# EAGLE design Dc motor control (EAGLE 7.7.0)
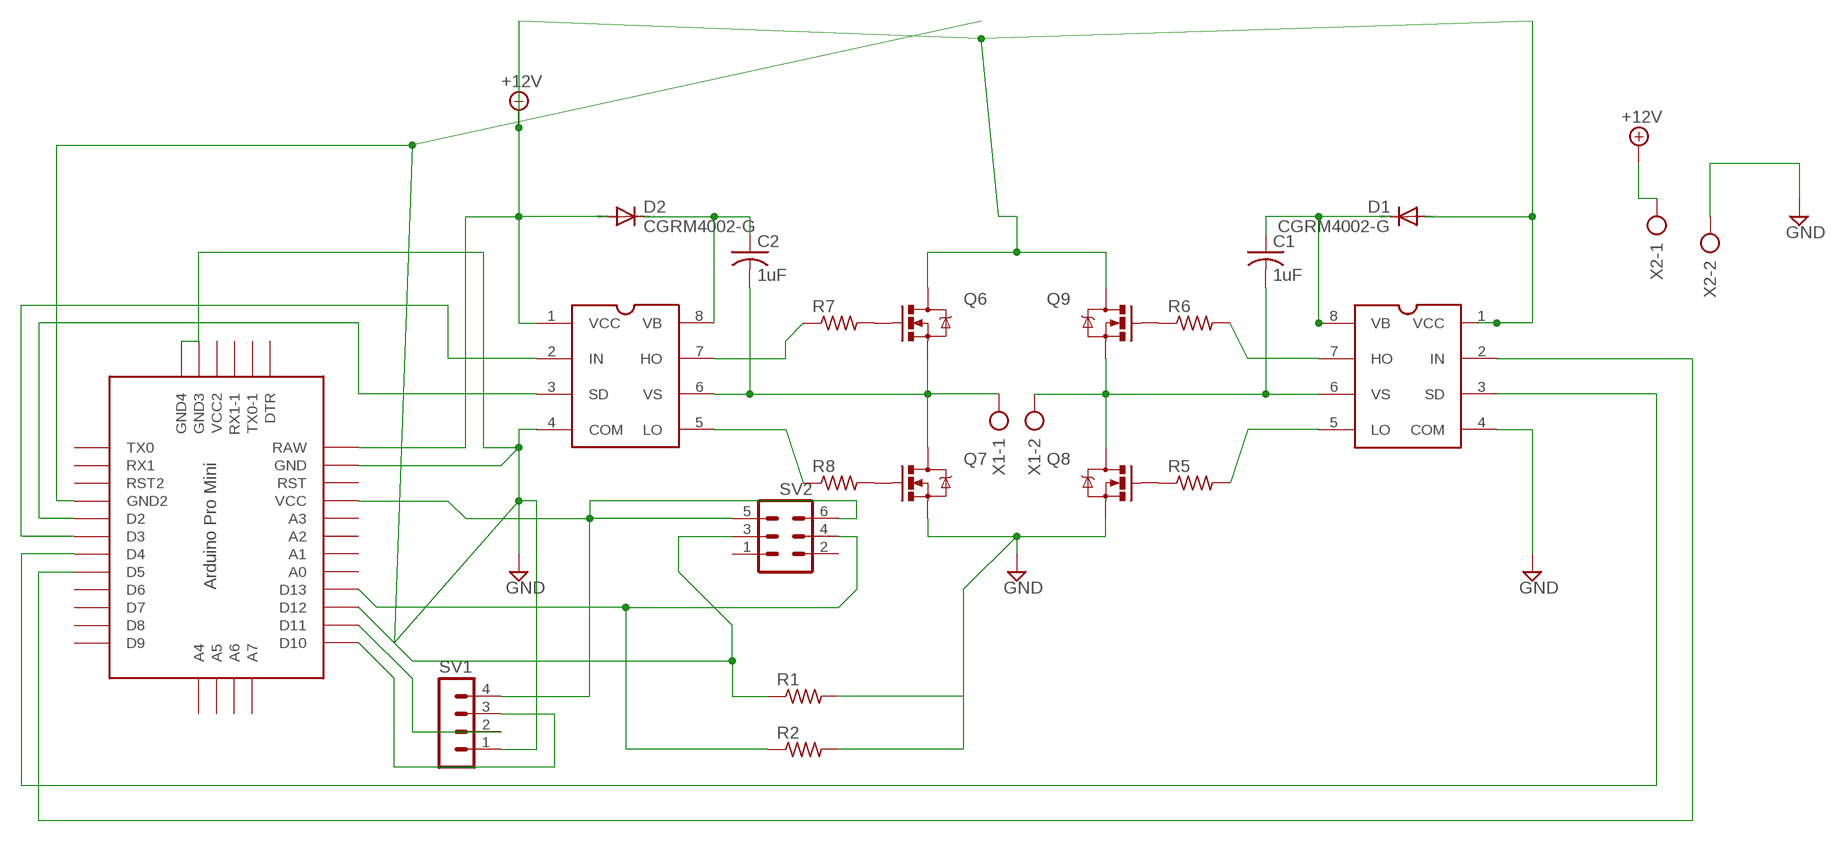
[diagram p0: schematic, sheet 1]

## Parts
C1  1uF  C-USC1210  [C1210]
C2  1uF  C-USC1210  [C1210]
D1  CGRM4002-G  [SOD-123_MINI-SMA]
D2  CGRM4002-G  [SOD-123_MINI-SMA]
Q6  MOSFET-NCHANNELFDD8580  [DPAK]
Q7  MOSFET-NCHANNELFDD8580  [DPAK]
Q8  MOSFET-NCHANNELFDD8580  [DPAK]
Q9  MOSFET-NCHANNELFDD8580  [DPAK]
R1  R-US_R0402  [R0402]
R2  R-US_R0402  [R0402]
R5  R-US_R0402  [R0402]
R6  R-US_R0402  [R0402]
R7  R-US_R0402  [R0402]
R8  R-US_R0402  [R0402]
SV1  MA04-1  [MA04-1]
SV2  MA03-2  [MA03-2]
U$1  IR2104S  [IR2104S]
U$2  IR2104S  [IR2104S]
U$3  PRO-MINI  [PRO-MINI]
X1  AK500/2-H  [AK500/2-H]
X2  AK500/2-H  [AK500/2-H]

## Nets
+12V: D1.A D2.A Q6.4(D) Q9.4(D) U$1.1(VCC) U$2.1(VCC) U$3.RAW X2.1
GND: Q7.3(S) Q8.3(S) R1.2 R2.2 SV1.1 U$1.4(COM) U$2.4(COM) U$3.GND U$3.GND1(GND2) U$3.GND2(GND4) U$3.GND3 X2.2
N$1: C2.2 Q6.3(S) Q7.4(D) U$2.6(VS) X1.1
N$2: C1.2 Q8.4(D) Q9.3(S) U$1.6(VS) X1.2
N$3: Q7.1(G) R8.2
N$4: Q6.1(G) R7.2
N$5: C1.1 D1.C U$1.8(VB)
N$6: R7.1 U$2.7(HO)
N$7: R8.1 U$2.5(LO)
N$8: R5.2 U$1.5(LO)
N$9: R6.2 U$1.7(HO)
N$10: Q8.1(G) R5.1
N$11: C2.1 D2.C U$2.8(VB)
N$12: Q9.1(G) R6.1
N$13: U$2.2(IN) U$3.D3
N$14: U$1.3(SD) U$3.D4
N$15: U$2.3(SD) U$3.D2
N$16: U$1.2(IN) U$3.D5
N$17: R2.1 SV2.4 U$3.D13
N$19: SV1.3 U$3.D10
N$20: SV1.4 SV2.5 SV2.6 U$3.VCC
N$21: SV1.2 U$3.D11
N$22: R1.1 SV2.3 U$3.D12
Unconnected: SV2.1 SV2.2 U$3.A0 U$3.A1 U$3.A2 U$3.A3 U$3.A4 U$3.A5 U$3.A6 U$3.A7 U$3.D6 U$3.D7 U$3.D8 U$3.D9 U$3.DTR U$3.RST U$3.RST1(RST2) U$3.RX1 U$3.RX1-1 U$3.TX0 U$3.TX0-1 U$3.VCC1(VCC2)

## Library data of the parts
C1 C2 = rcl:C-US: CAPACITOR, American symbol
D1 D2 = diode:CGRM400*-G: Molded plasitc,JEDEC SOD-123/Mini SMA Source: Comchip CGRM4001-G.pdf
Q6-Q9 = fets:MOSFET-NCHANNEL: Generic NMOS footprint
R1 R2 R5-R8 = rcl:R-US_: RESISTOR, American symbol
SV1 = con-lstb:MA04-1: PIN HEADER; OC_FARNELL: unknown; OC_NEWARK: unknown
SV2 = con-lstb:MA03-2: PIN HEADER; OC_FARNELL: unknown; OC_NEWARK: unknown
U$1 U$2 = ir-2104:IR2104S: Half Bridge Mosfet - IGBT driver SOIC
U$3 = Arduino-clone:PRO-MINI: Arduion Pro Mini Clone V1.0 www.betemcu.cu
X1 X2 = con-ptr500:AK500/2-H: CONNECTOR Aug. 2004 / PTR Meßtechnik: Die Bezeichnung der Serie AK505 wurde geändert. Es handelt sich hierbei um AK500 in horizontaler Ausführung.; OC_FARNELL: unknown; OC_NEWARK: unknown

## Board
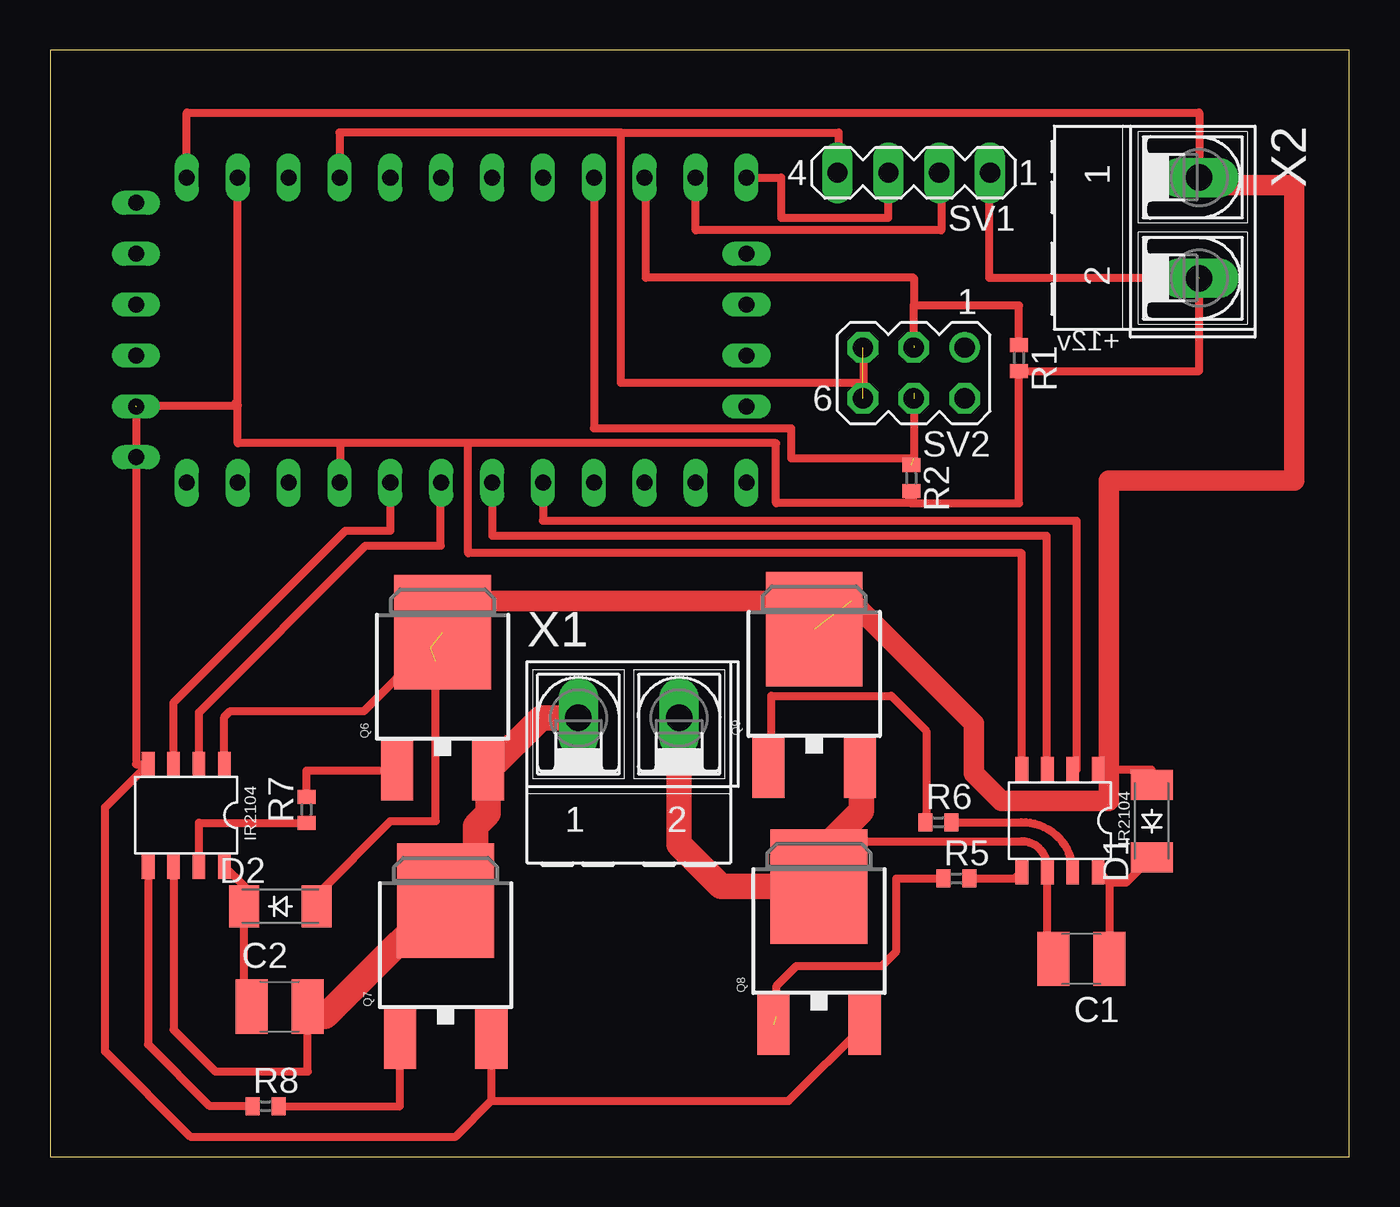
[diagram p1: board, top side]
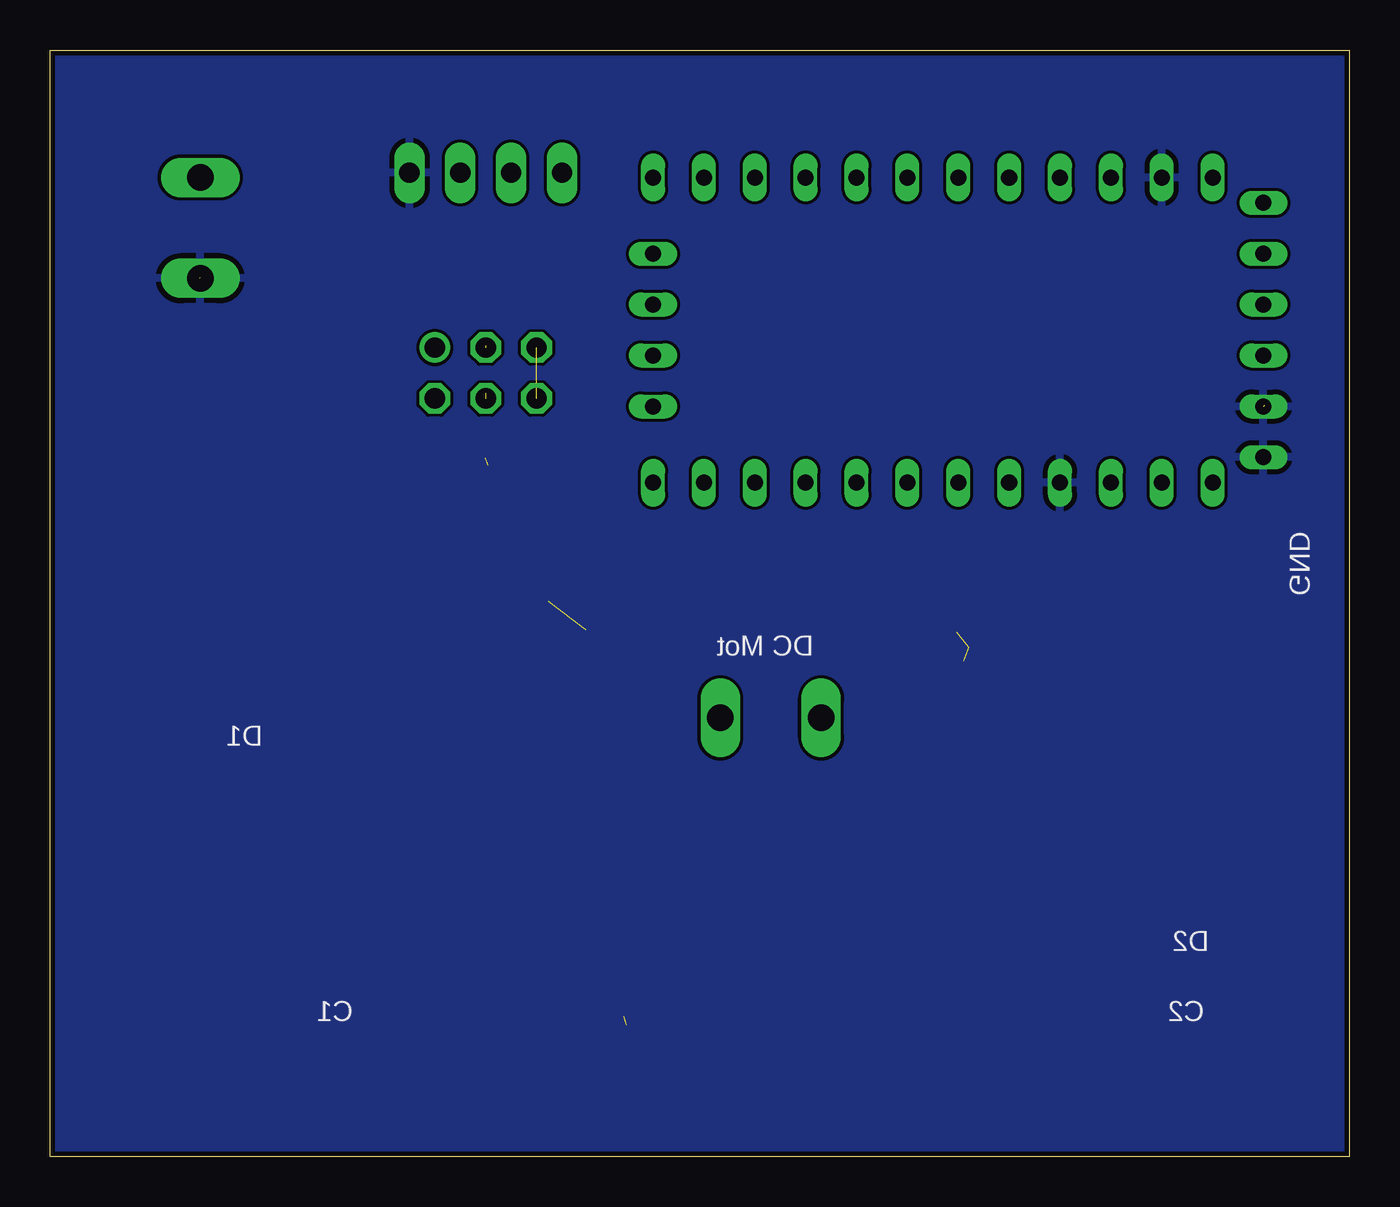
[diagram p2: board, bottom side, seen from below]

Size 64.88 x 55.25 mm. Coordinates in mm from the lower left corner, seen from the top.
Outline: 0,0 64.88,0 64.88,55.25 0,55.25 0,0
Copper layers (1*2*15*16): Top 0.035mm / dielectric 0.2mm / layer 2 0.0175mm / dielectric 1.1mm / layer 15 0.0175mm / dielectric 0.2mm / Bottom 0.035mm
Design rules "SeeedStudio_DRU_no_angle_20130527": minimum track width 6mil, minimum drill 12mil, track to track 6mil, track to pad 6mil, pad to pad 6mil, via to via 6mil, smd to smd 0mil, copper to edge 10mil, drill to drill 10mil, minimum pad ring 6mil, minimum via ring 6mil, stop-mask expansion 2mil, vias tented up to drill 25mil, thermal gap 10mil

### Footprints (pad centres in the part's own frame; a part is rotated, then mirrored left to right if it is on the bottom)
C1210 = smd 1.6 x 2.7: 1 -1.4,0; 2 1.4,0
SOD-123_MINI-SMA = smd 1.5 x 2.1: A 1.8,0; C -1.8,0
DPAK = smd 1.6 x 3: 1 -2.28,-5.31; 3 2.28,-5.31 | smd 4.826 x 5.715: 4 0,1.588
R0402 = smd 0.7 x 0.9: 1 -0.65,0; 2 0.65,0
MA04-1 = drill 1.016 long: 1 -3.81,0; 2 -1.27,0; 3 1.27,0; 4 3.81,0
MA03-2 = drill 1.016: 1 -2.54,-1.27 | drill 1.016 octagon: 2 -2.54,1.27; 3 0,-1.27; 4 0,1.27; 5 2.54,-1.27; 6 2.54,1.27
IR2104S = smd 1.27 x 0.635: 1 0,3.81; 2 0,2.54; 3 0,1.27; 4 0,0; 5 5.08,0; 6 5.08,1.27; 7 5.08,2.54; 8 5.08,3.81
PRO-MINI = drill 0.8 long: A0 8.89,8.89; A1 8.89,11.43; A2 8.89,13.97; A3 8.89,16.51; A4 -2.54,-1.27; A5 0,-1.27; A6 2.54,-1.27; A7 5.08,-1.27; D2 -6.35,16.51; D3 -6.35,13.97; D4 -6.35,11.43; D5 -6.35,8.89; D6 -6.35,6.35; D7 -6.35,3.81; D8 -6.35,1.27; D9 -6.35,-1.27; D10 8.89,-1.27; D11 8.89,1.27; D12 8.89,3.81; D13 8.89,6.35; DTR 7.62,29.21; GND 8.89,24.13; GND1 -6.35,19.05; GND2 -5.08,29.21; GND3 -2.54,29.21; RAW 8.89,26.67; RST 8.89,21.59; RST1 -6.35,21.59; RX1 -6.35,24.13; RX1-1 2.54,29.21; TX0 -6.35,26.67; TX0-1 5.08,29.21; VCC 8.89,19.05; VCC1 0,29.21
AK500/2-H = drill 1.321 long: 1 -2.515,0; 2 2.515,0

### Placement (x,y rotation side)
C1  51.49,9.87 180 top
C2  11.47,7.49 0 top
D1  55,16.75 90 top
D2  11.5,12.5 0 top
Q6  19.6,24.59 0 top
Q7  19.75,11.19 0 top
Q8  38.39,11.9 0 top
Q9  38.15,24.73 0 top
R1  48.38,39.88 270 top
R2  43,33.88 270 top
R5  45.26,13.88 0 top
R6  44.36,16.7 0 top
R7  12.8,17.32 90 top
R8  10.77,2.52 0 top
SV1  43.12,49.12 180 top
SV2  43.12,39.12 180 top
U$1  48.52,19.32 270 top
U$2  4.89,19.58 270 top
U$3  33.5,40 90 top
X1  28.89,21.91 0 top
X2  57.38,46.38 270 top

### Tracks (layer width: path | path; a pad name or v marks a point on that pad's centre or on a via)
+12V  (3 unrouted)
  Top 0.406: U$2.1 8.7,21.95 9,22.25 15.67,22.25 18.84,25.41 19,25.41 | D2.A 13.3,13.05 17,16.75 19.25,16.75 19.25,24.75 | D1.A 55,19.32 52.88,19.32 U$1.1 | U$3.RAW 6.83,52.12 57.38,52.12 X2.1
  Top 1.016: X2.1 57.38,48.52 62.12,48.52 62.12,33.75 52.88,33.75 52.88,19.32 52.88,17.75 47.5,17.75 46.12,19.12 46.12,21.62 40,27.75 19.6,27.75 Q6.4
GND  (2 unrouted)
  Top 0.406: Q7.3 22.03,2.78 | 22.03,2.78 20.25,1 7,1 2.75,5.25 2.75,17.44 U$2.4 4.29,19.58 U$3.GND3 | 22.03,2.78 36.87,2.78 Q8.3 | 20.88,35.62 36.25,35.62 36.25,32.62 43,32.62 | 20.88,35.62 14.5,35.62 | 14.5,35.62 9.37,35.62 U$3.GND | U$1.4 48.52,30.12 20.88,30.12 20.88,35.62 | X2.2 57.38,39.23 R1.2 48.38,32.62 43,32.62 | R2.2 43,32.62 | 4.25,37.5 9.38,37.5 9.25,37.62 | 46.88,49.12 46.88,43.88 57.38,43.88 | 14.5,33.62 14.5,35.62
  pour Bottom: 0,55.25 0,0 64.88,0 64.88,55.25
N$1
  Top 0.406: U$2.6 6.16,6.34 8.25,4.25 12.87,4.25 C2.2 | Q7.4 19.75,14 21.25,15.5
  Top 1.27: C2.2 13.74,6.99 21.25,14.5 21.25,15.5 21.25,16.5 21.88,17.13 Q6.3 24.51,21.91 X1.1
N$2
  Top 0.406: C1.2 arc-90 49.79,10.23 U$1.6 arc16 49.75,14.75 arc77 48.5,15.75 39.75,15.75 39.5,15.5 39,15 38.39,14.39 Q8.4
  Top 1.27: X1.2 31.41,15.59 33.5,13.5 38.38,13.5 Q8.4 | Q9.3 40.5,19.35 40.5,17.25 39,15.75 39,15
N$3
  Top 0.406: R8.2 17.47,2.52 Q7.1
N$4
  Top 0.406: R7.2 12.8,19.28 Q6.1
N$5
  Top 0.406: U$1.8 52.89,13.67 | 52.89,13.67 C1.1 | D1.C 53.72,13.67 52.89,13.67
N$6
  Top 0.406: U$2.7 7.43,16.67 R7.1
N$7
  Top 0.406: U$2.5 4.89,5.61 7.98,2.52 R8.1
N$8
  Top 0.406: R5.2 48.17,13.88 U$1.5
N$9
  Top 0.406: R6.2 48.47,16.7 arc-90 U$1.7
N$10  (1 unrouted)
  Top 0.406: R5.1 42.25,13.88 42.25,10.25 41.5,9.5 37.25,9.5 36.25,8.5 36.25,7
N$11
  Top 0.406: U$2.8 9.7,13.51 D2.C 9.7,7.36 C2.1
N$12
  Top 0.406: Q9.1 36,19.42 36,23 42,23 43.75,21.25 43.75,17.11 R6.1
N$13
  Top 0.406: U$2.2 7.43,22.18 15.75,30.5 19.5,30.5 19.5,33.62 U$3.D3
N$14
  Top 0.406: U$3.D4 22.07,31 49.75,31 49.75,19.32 U$1.3
N$15
  Top 0.406: U$2.3 6.16,22.66 14.75,31.25 17,31.25 U$3.D2
N$16
  Top 0.406: U$3.D5 24.61,31.75 51.25,31.75 51.25,19.32 U$1.2
N$17  (2 unrouted)
  Top 0.406: U$3.D13 27.15,36.38 37,36.38 37,34.88 43.12,34.88 43.12,38.12
N$18
  Top 0.406: 42.88,33.12 42.88,32.75 43.12,32.75
N$19
  Top 0.406: U$3.D10 36.5,48.89 36.5,46.88 41.85,46.88 SV1.3
N$20  (2 unrouted)
  Top 0.406: 28.5,51.12 28.5,38.62 40.59,38.62 40.59,38.38 | 28.5,51.12 14.45,51.12 U$3.VCC | 28.5,51.12 39.38,51.12 39.38,49.12 SV1.4
N$21
  Top 0.406: SV1.2 44.5,49.12 44.5,46.25 32.23,46.25 U$3.D11
N$22  (1 unrouted)
  Top 0.406: R1.1 48.38,42.5 43.12,42.5 | U$3.D12 29.75,48.89 29.75,43.88 43.12,43.88 43.12,42.5 | 43.25,40.5 43.12,40.5 43.12,42 43.12,42.5
N$23
  Top 0.406: 40.62,37.75 40.62,40.5

### Text on the board
tNames: +12v
bNames: GND | DC Mot | D1 | D2 | C2 | C1